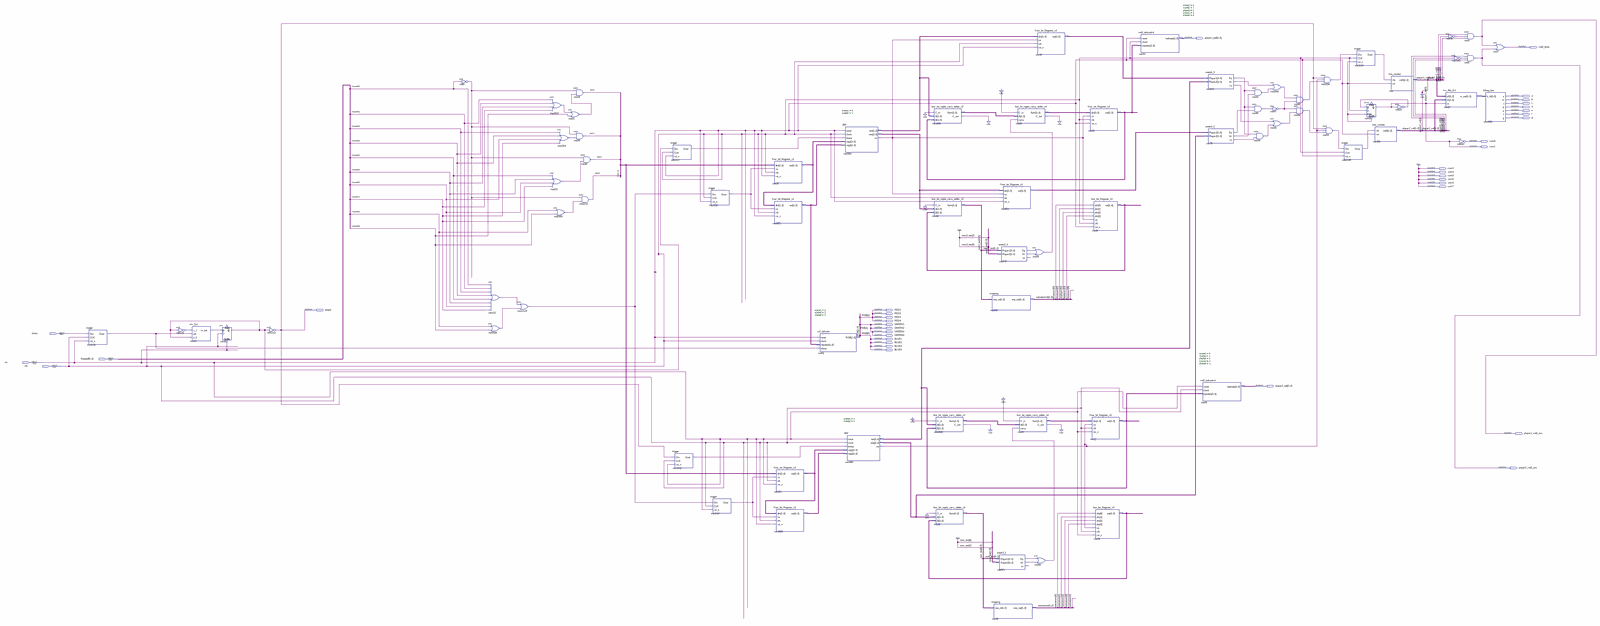
[diagram p0: schematic sheet, whole]
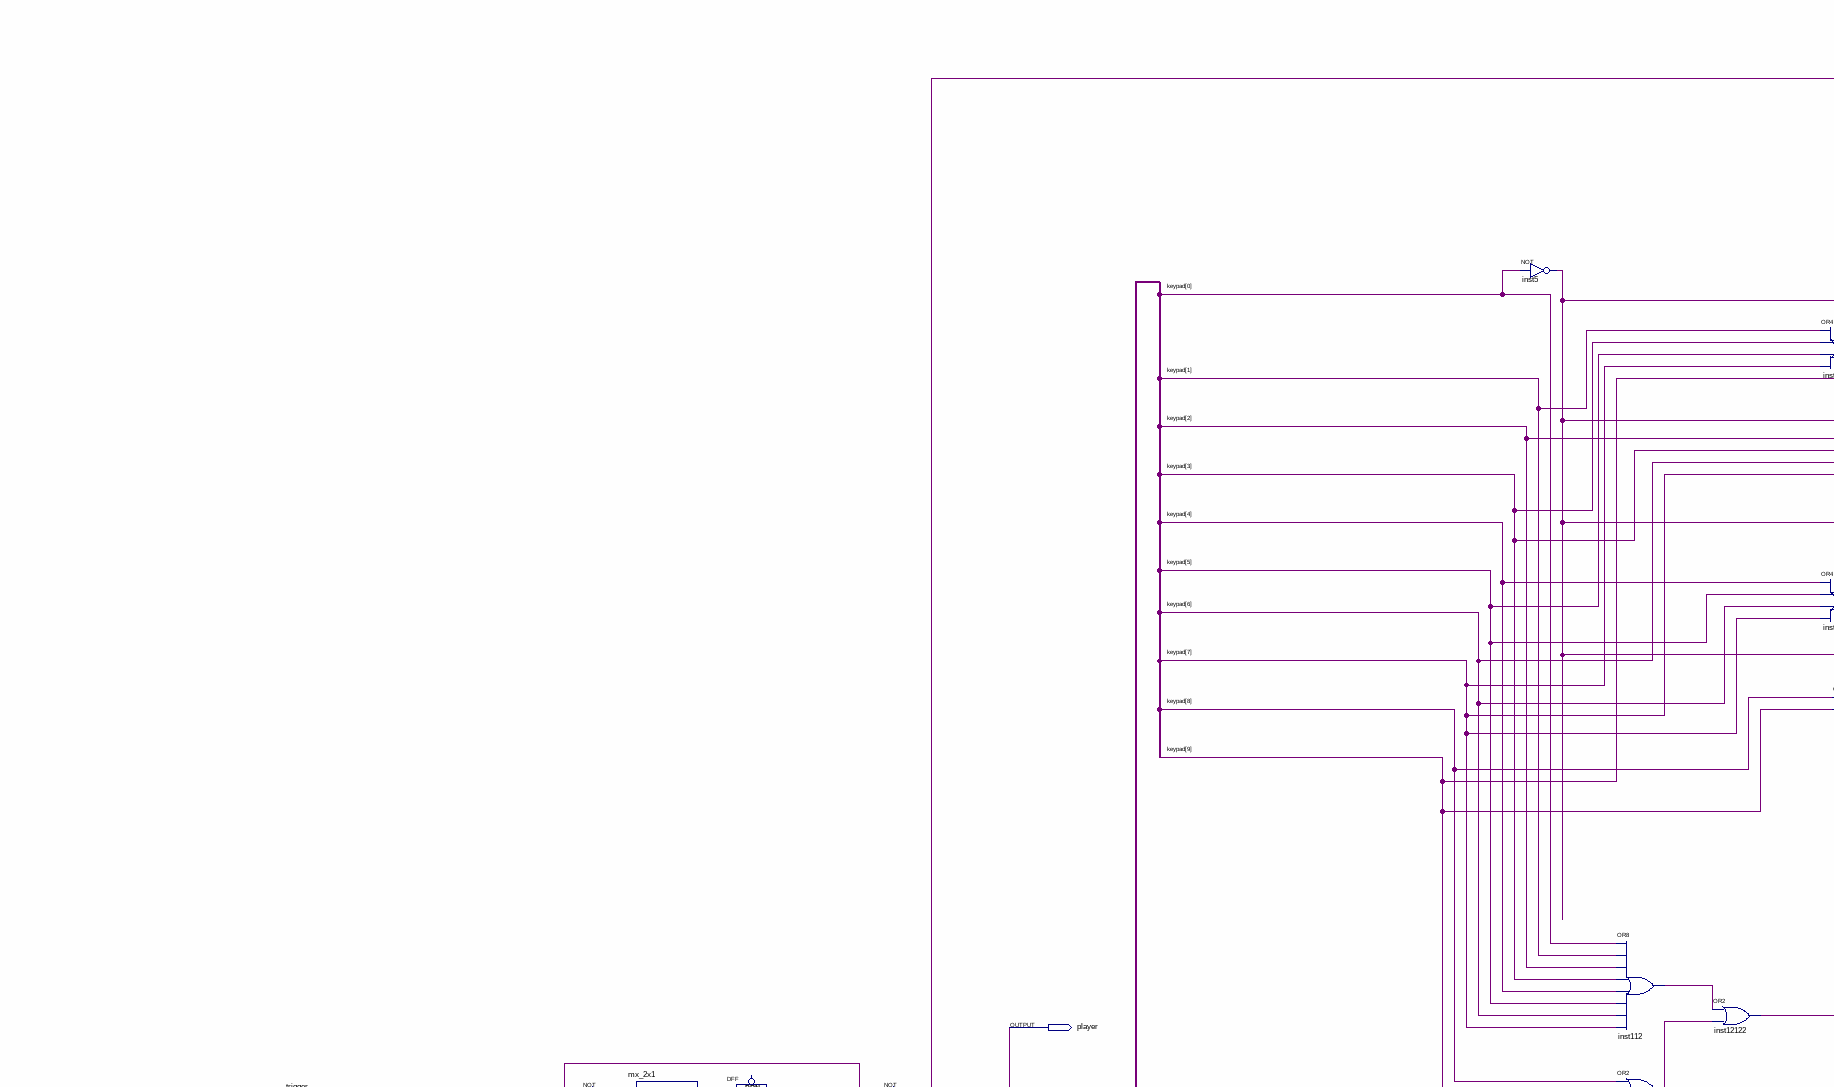
[diagram p1: schematic sheet, upper left part]
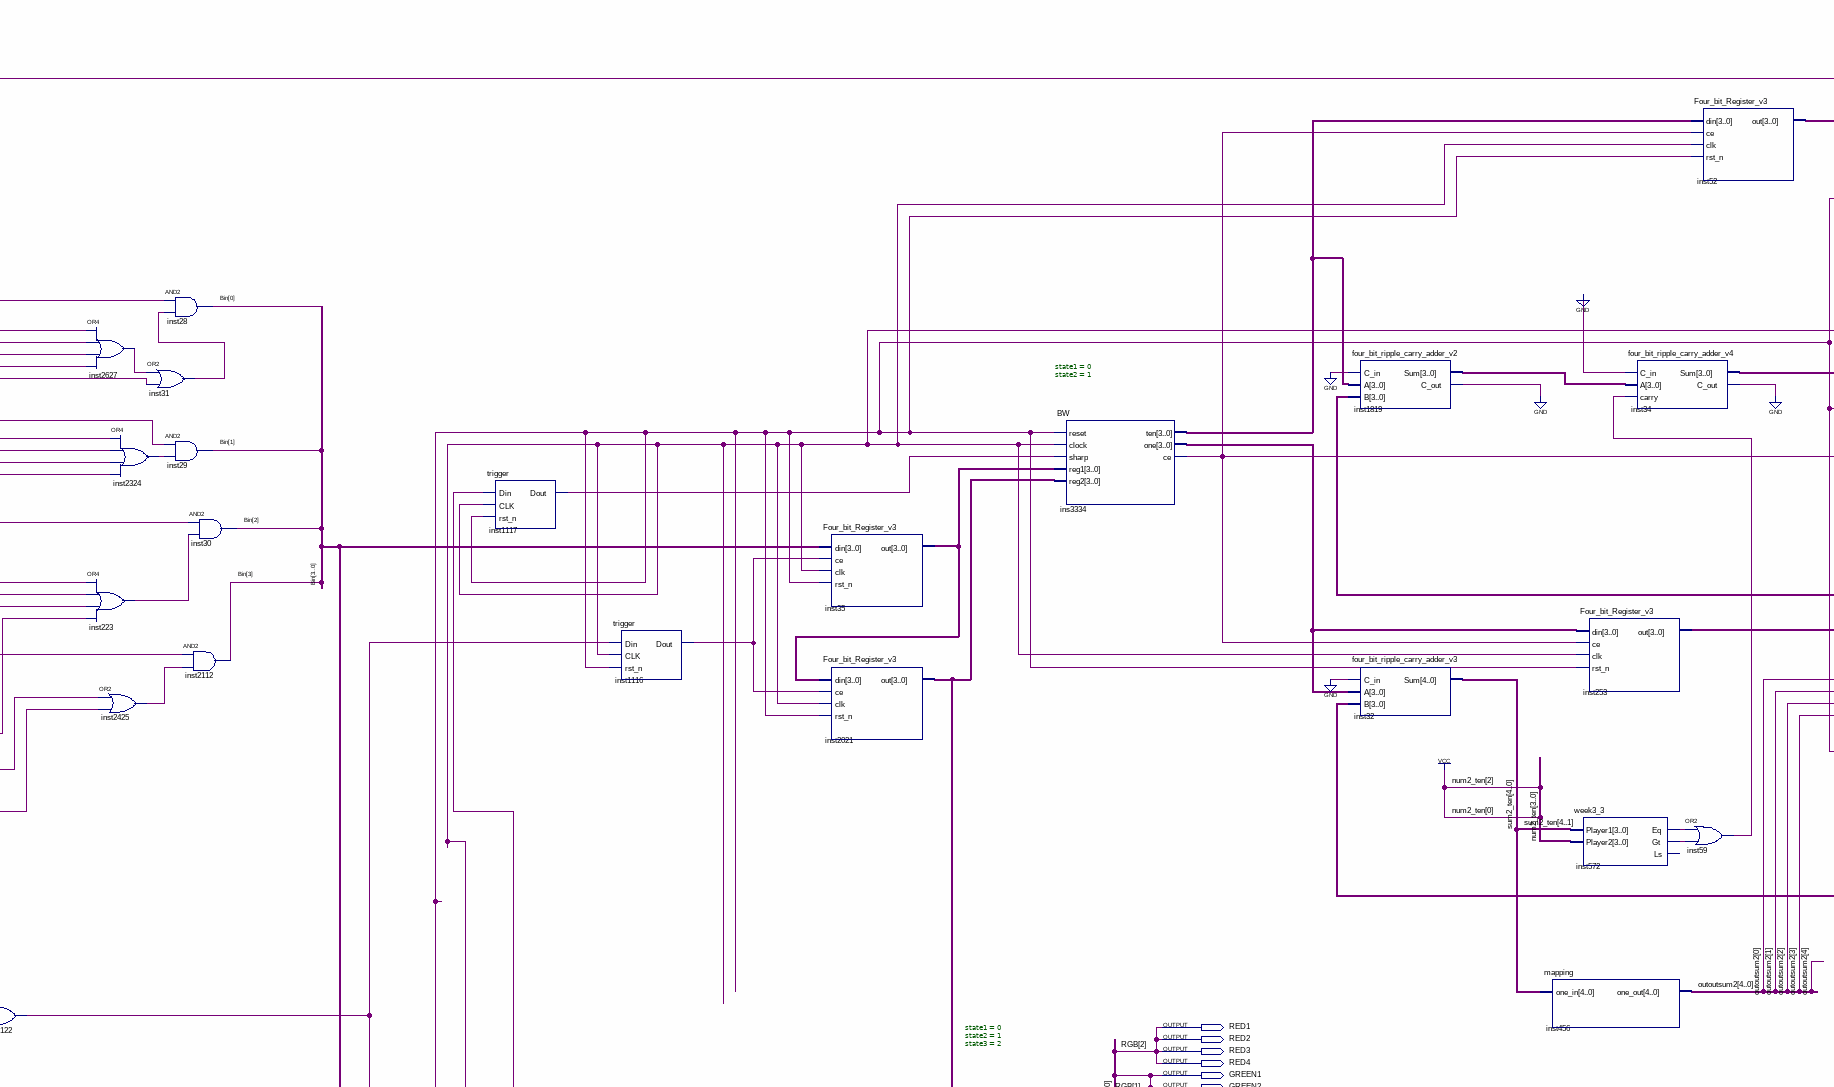
[diagram p2: schematic sheet, upper centre part]
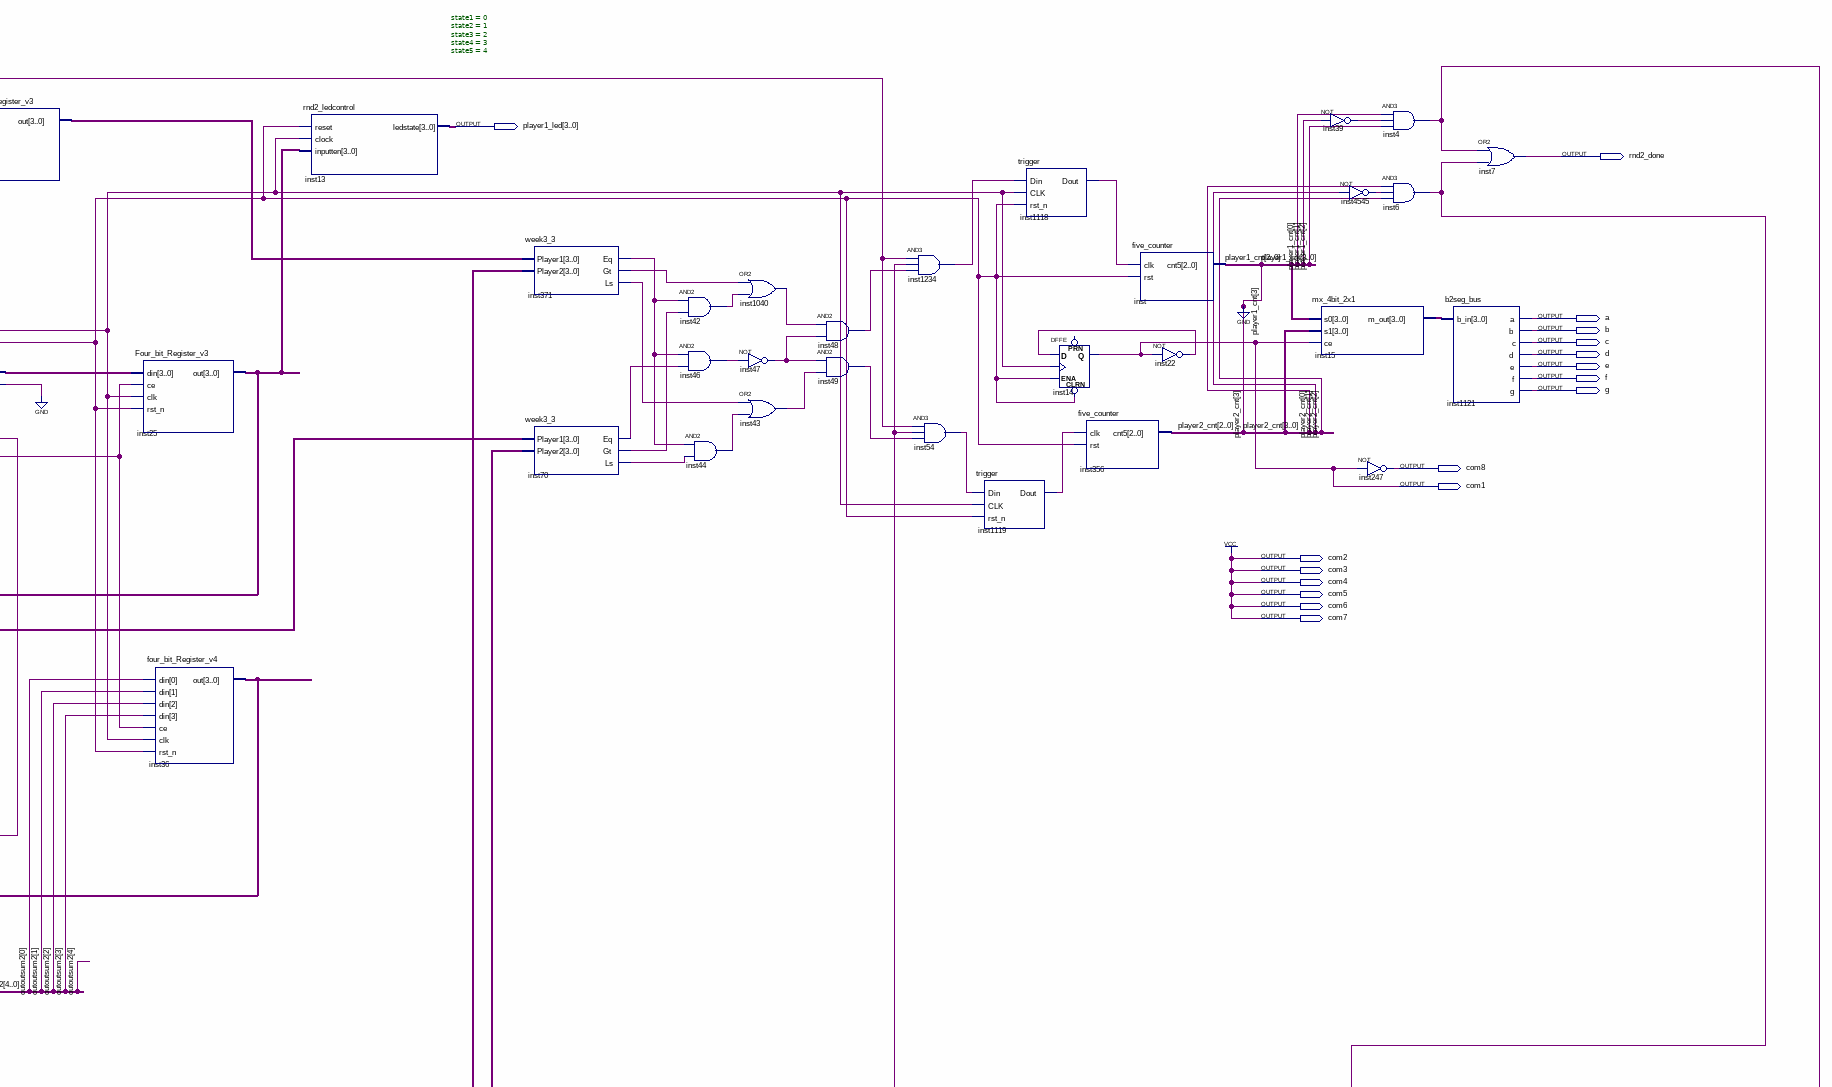
[diagram p3: schematic sheet, upper right part]
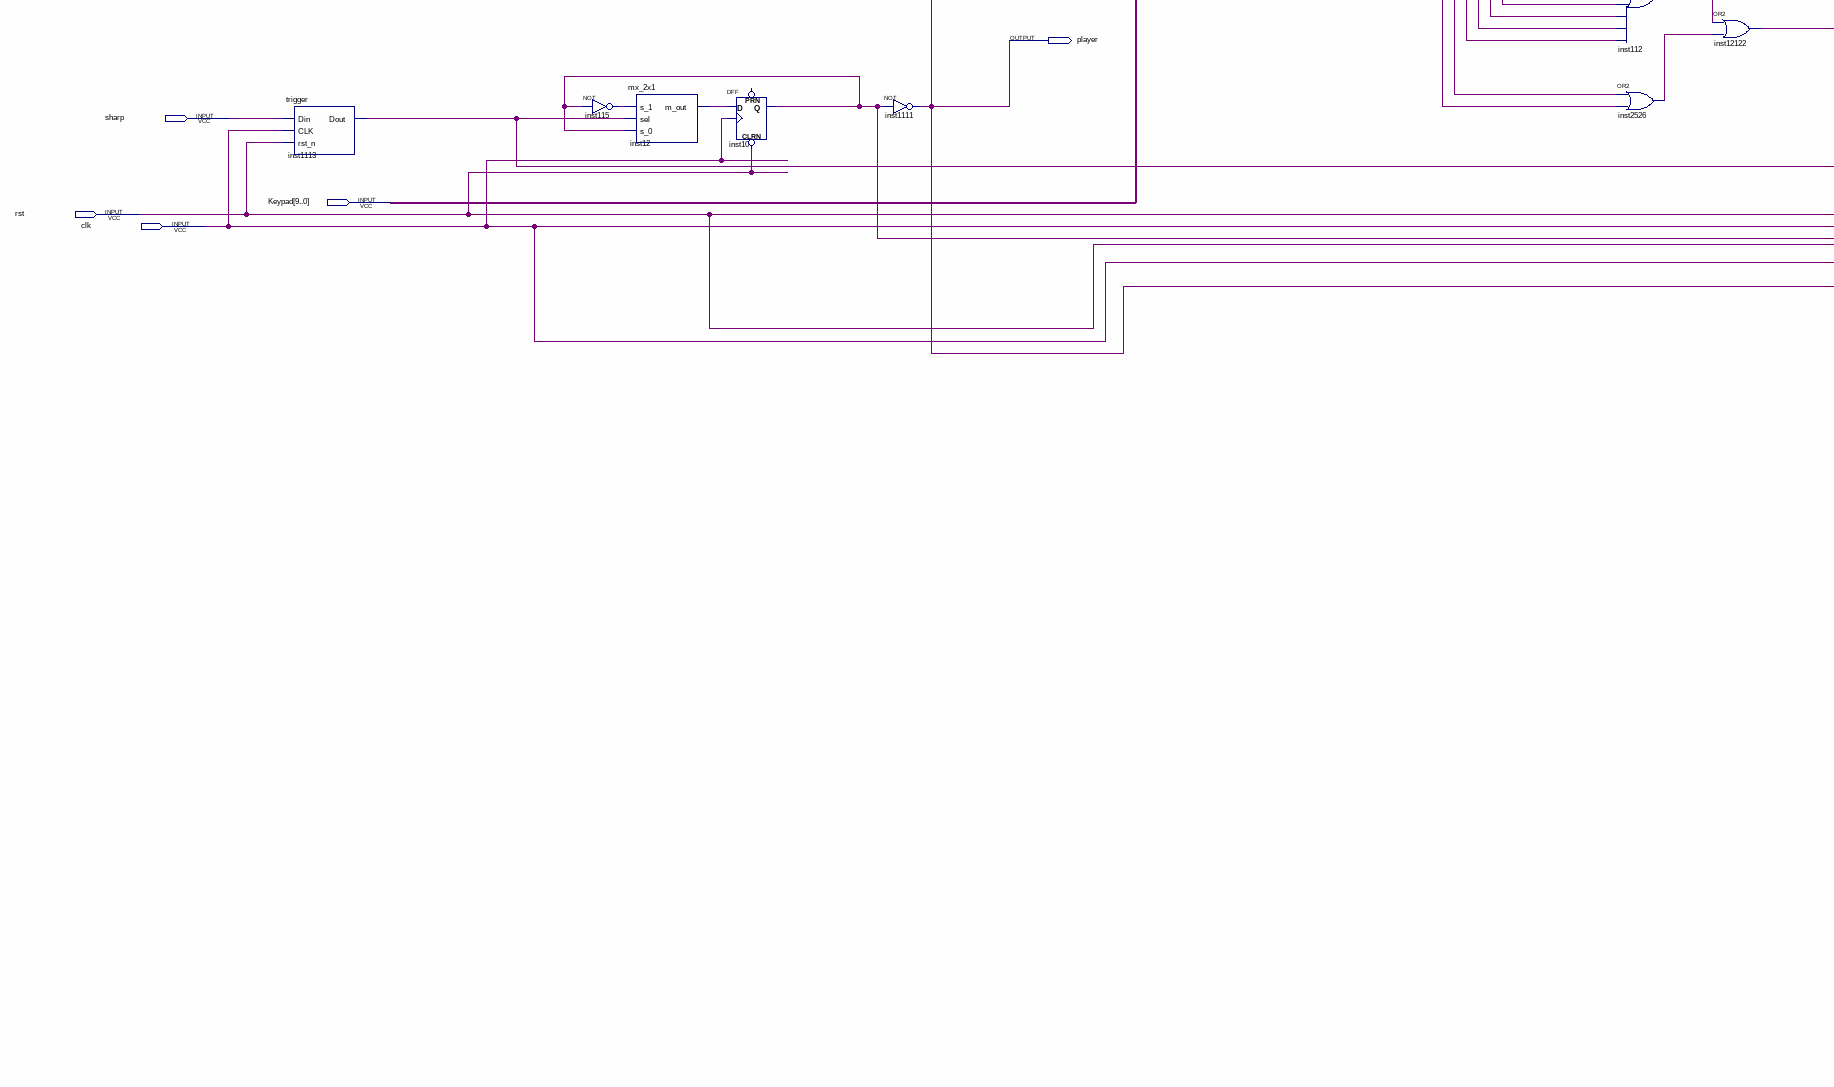
[diagram p4: schematic sheet, lower left part]
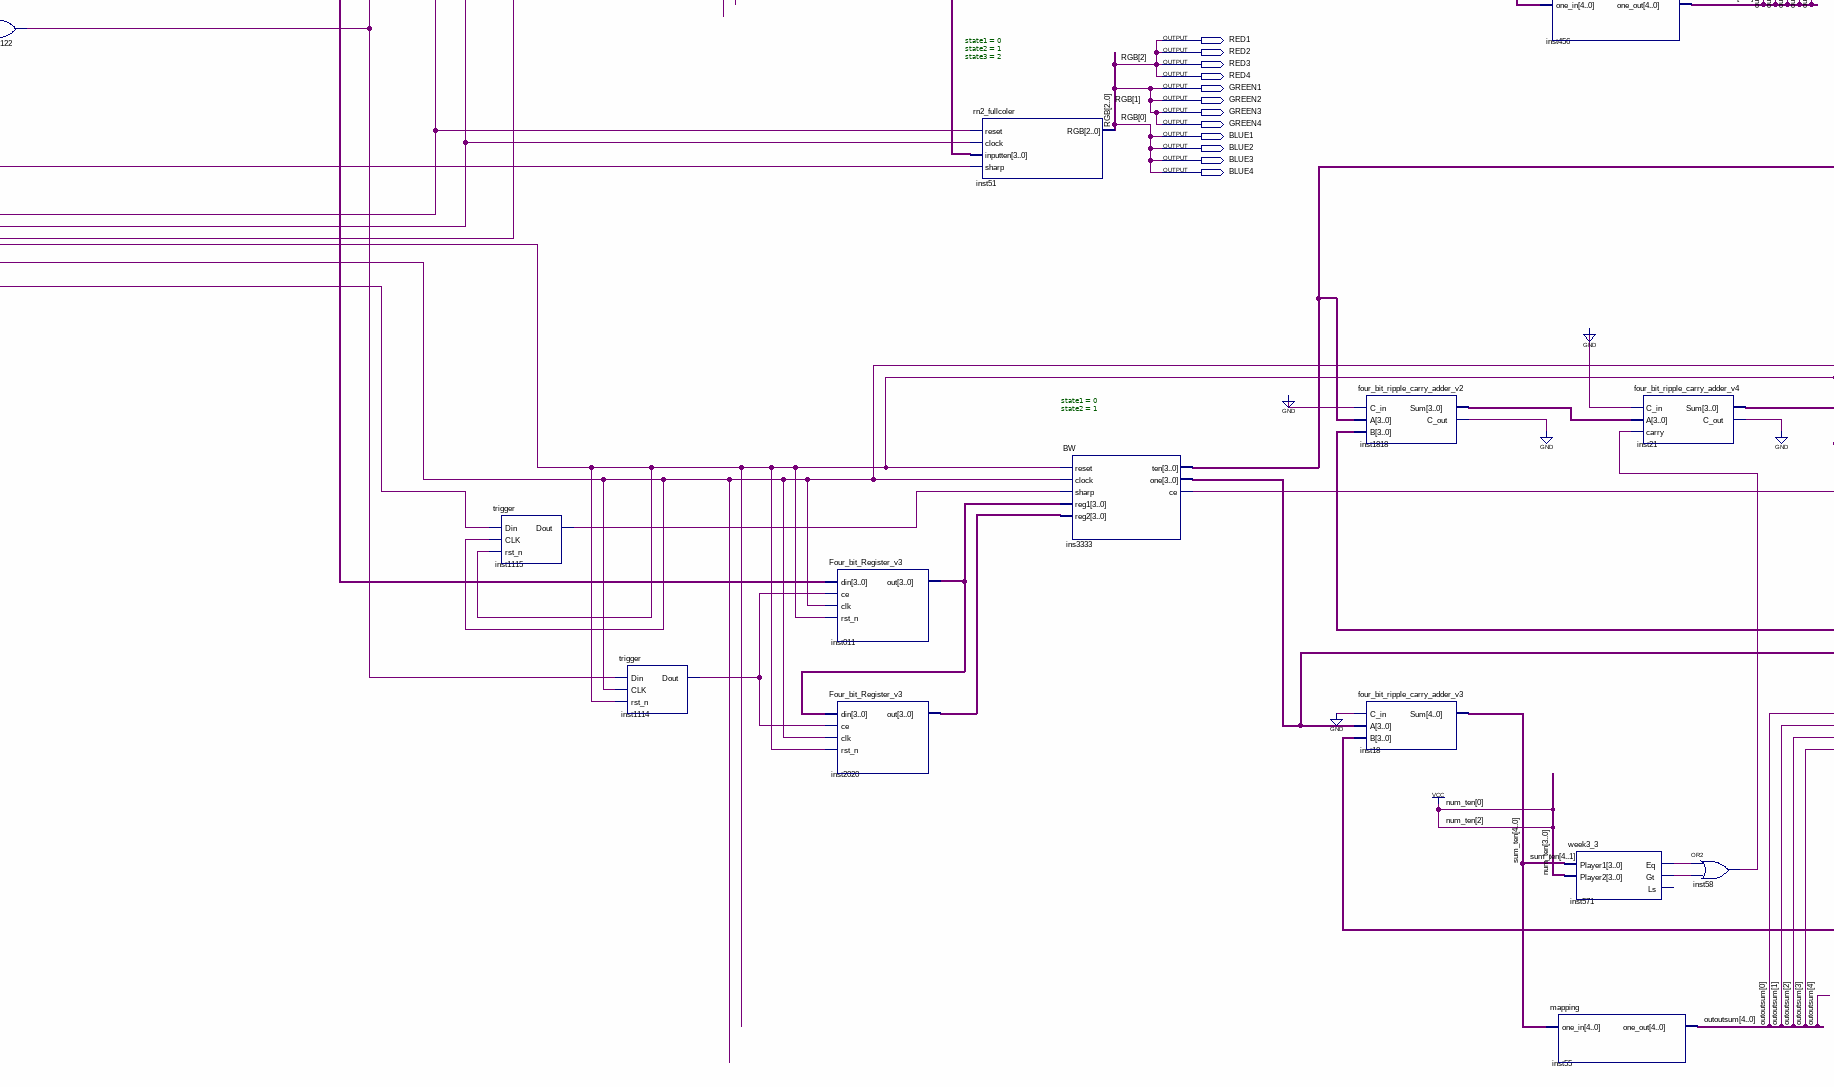
[diagram p5: schematic sheet, lower centre part]
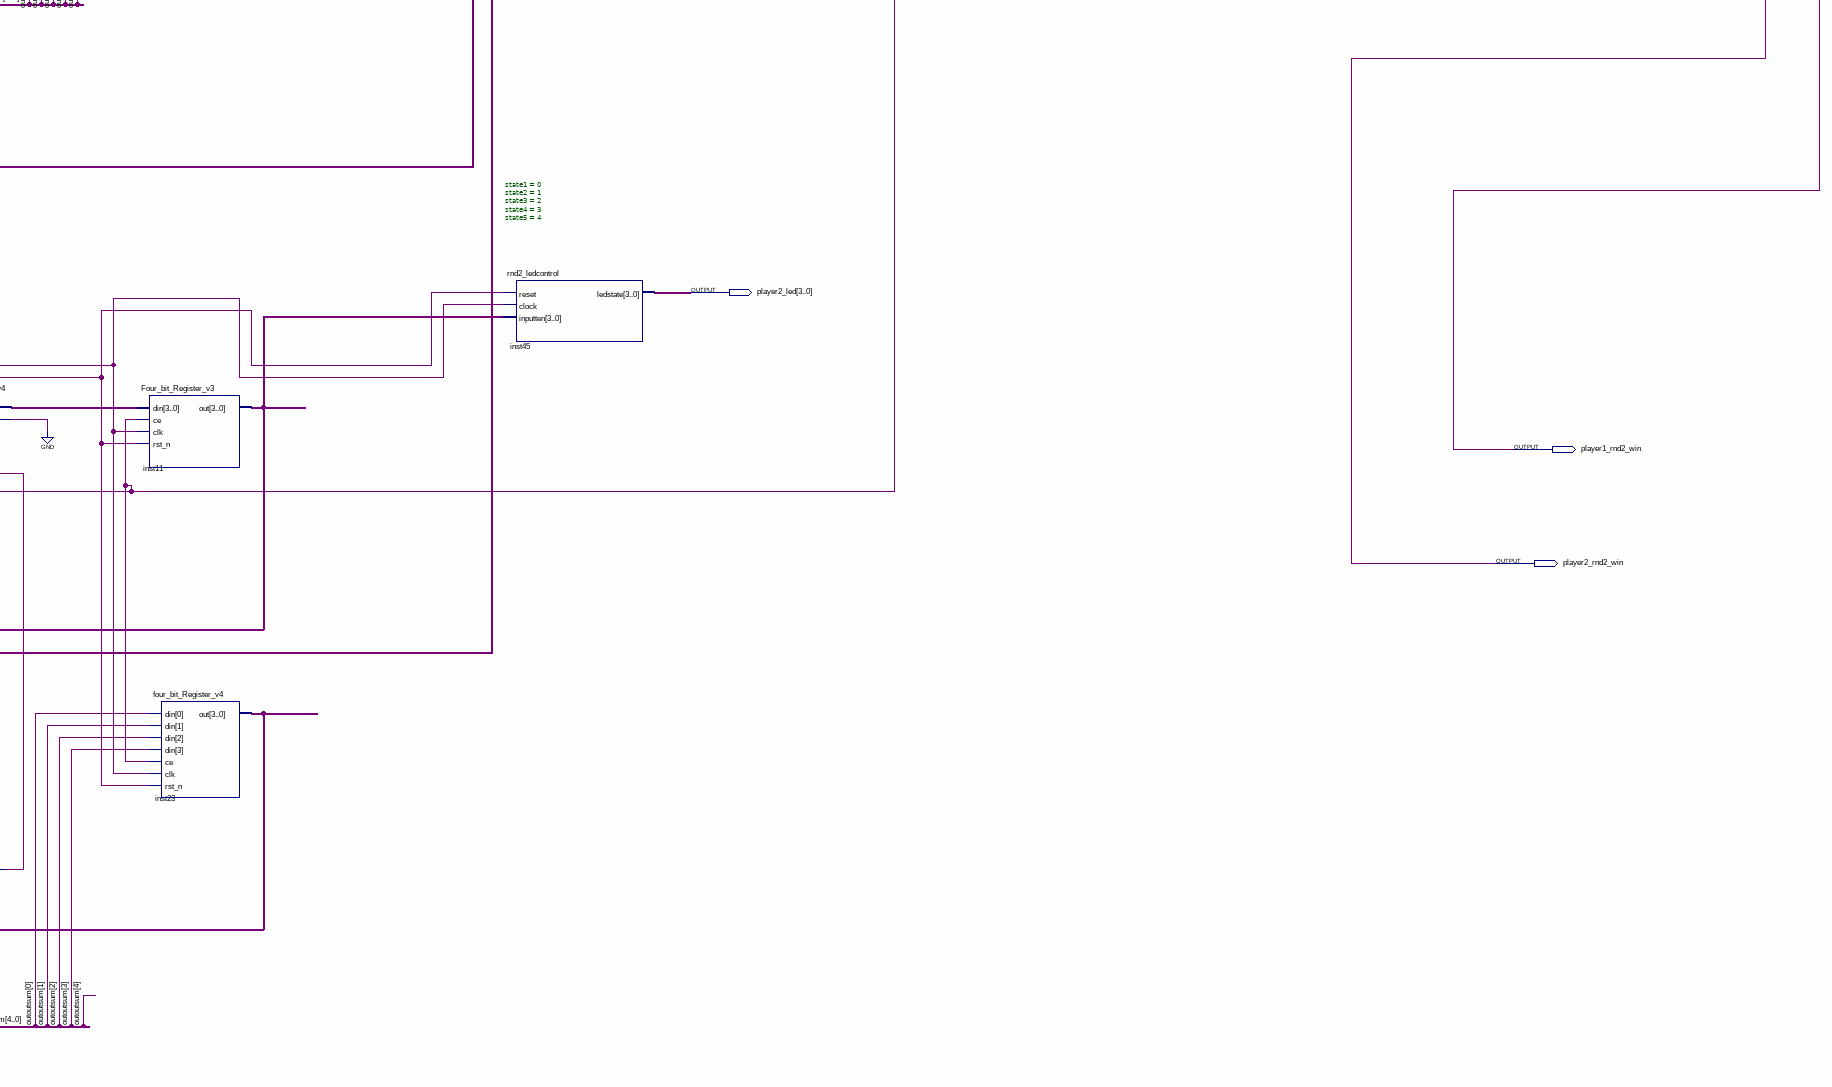
[diagram p6: schematic sheet, lower right part]
// Quartus schematic rnd2_player.bdf as structural Verilog: 75 symbols, 37 pins
module rnd2_player (
  input  sharp,
  input  [9:0] Keypad,
  input  rst,
  input  clk,
  output [3:0] player1_led,
  output rnd2_done,
  output a,
  output b,
  output c,
  output d,
  output e,
  output f,
  output g,
  output com8,
  output com1,
  output com2,
  output com3,
  output com4,
  output com5,
  output com6,
  output com7,
  output player,
  output RED1,
  output RED2,
  output RED3,
  output RED4,
  output GREEN1,
  output GREEN2,
  output GREEN3,
  output GREEN4,
  output BLUE1,
  output BLUE2,
  output BLUE3,
  output BLUE4,
  output [3:0] player2_led,
  output player1_rnd2_win,
  output player2_rnd2_win
);

  wire ins3333_ce, ins3334_ce, inst5_out, inst10_q, inst12_m_out, inst21_c_out, inst22_out, inst31_out,
       inst34_c_out, inst39_out, inst42_out, inst43_out, inst44_out, inst46_out, inst47_out, inst48_out,
       inst49_out, inst54_out, inst58_out, inst59_out, inst70_eq, inst70_gt, inst70_ls, inst112_out,
       inst115_out, inst223_out, inst371_eq, inst371_gt, inst371_ls, inst571_eq, inst571_gt, inst572_eq,
       inst572_gt, inst1040_out, inst1113_dout, inst1114_dout, inst1115_dout, inst1116_dout, inst1117_dout,
       inst1118_dout, inst1119_dout, inst1234_out, inst1818_c_out, inst1819_c_out, inst2324_out,
       inst2425_out, inst2526_out, inst2627_out, inst4545_out, inst12122_out;
  wire [2:0] player1_cnt, player2_cnt;
  wire [3:0] Bin, ins3333_one, ins3333_ten, ins3334_one, ins3334_ten, inst011_out, inst11_out, inst15_m_out,
       inst21_sum, inst23_out, inst25_out, inst34_sum, inst35_out, inst36_out, inst52_out, inst253_out,
       inst1818_sum, inst1819_sum, inst2020_out, inst2021_out;
  wire [3:1] num2_ten, num_ten;
  wire [4:0] outoutsum, outoutsum2, sum2_ten, sum_ten;

  trigger inst1113 (.Din(sharp), .CLK(clk), .rst_n(rst), .Dout(inst1113_dout));
  not inst115 (inst115_out, inst10_q);
  mx_2x1 inst12 (.s_1(inst115_out), .sel(inst1113_dout), .s_0(inst10_q), .m_out(inst12_m_out));
  DFF inst10 (.CLRN(rst), .CLK(clk), .D(inst12_m_out), .Q(inst10_q));  // open: PRN
  not inst1111 (player, inst10_q);
  not inst5 (inst5_out, Keypad[0]);
  or inst112 (inst112_out, Keypad[0], Keypad[1], Keypad[2], Keypad[3], Keypad[4], Keypad[5], Keypad[6], Keypad[7]);
  or inst2526 (inst2526_out, Keypad[8], Keypad[9]);
  or inst12122 (inst12122_out, inst112_out, inst2526_out);
  or inst2627 (inst2627_out, Keypad[1], Keypad[3], Keypad[5], Keypad[7]);
  or inst2324 (inst2324_out, Keypad[2], Keypad[3], Keypad[6], Keypad[7]);
  or inst223 (inst223_out, Keypad[4], Keypad[5], Keypad[6], Keypad[7]);
  or inst2425 (inst2425_out, Keypad[8], Keypad[9]);
  and inst28 (Bin[0], inst5_out, inst31_out);
  or inst31 (inst31_out, inst2627_out, Keypad[9]);
  and inst29 (Bin[1], inst5_out, inst2324_out);
  and inst30 (Bin[2], inst5_out, inst223_out);
  and inst2112 (Bin[3], inst5_out, inst2425_out);
  trigger inst1117 (.Din(inst10_q), .CLK(clk), .rst_n(rst), .Dout(inst1117_dout));
  trigger inst1115 (.Din(player), .CLK(clk), .rst_n(rst), .Dout(inst1115_dout));
  trigger inst1116 (.Din(inst12122_out), .CLK(clk), .rst_n(rst), .Dout(inst1116_dout));
  trigger inst1114 (.Din(inst12122_out), .CLK(clk), .rst_n(rst), .Dout(inst1114_dout));
  Four_bit_Register_v3 inst35 (.din(Bin), .ce(inst1116_dout), .clk(clk), .rst_n(rst), .out(inst35_out));
  Four_bit_Register_v3 inst2021 (.din(inst35_out), .ce(inst1116_dout), .clk(clk), .rst_n(rst), .out(inst2021_out));
  Four_bit_Register_v3 inst011 (.din(Bin), .ce(inst1114_dout), .clk(clk), .rst_n(rst), .out(inst011_out));
  Four_bit_Register_v3 inst2020 (.din(inst011_out), .ce(inst1114_dout), .clk(clk), .rst_n(rst), .out(inst2020_out));
  rn2_fullcoler #(.state1(0), .state2(1), .state3(2)) inst51 (
    .reset(rst), .clock(clk), .inputten(inst2021_out), .sharp(inst1113_dout), .RGB({RED1, GREEN1, BLUE1}));
  BW #(.state1(0), .state2(1)) ins3334 (
    .reset(rst), .clock(clk), .sharp(inst1117_dout), .reg1(inst35_out), .reg2(inst2021_out),
    .ten(ins3334_ten), .one(ins3334_one), .ce(ins3334_ce));
  BW #(.state1(0), .state2(1)) ins3333 (
    .reset(rst), .clock(clk), .sharp(inst1115_dout), .reg1(inst011_out), .reg2(inst2020_out),
    .ten(ins3333_ten), .one(ins3333_one), .ce(ins3333_ce));
  four_bit_ripple_carry_adder_v2 inst1819 (
    .C_in(1'b0), .A(ins3334_ten), .B(inst25_out), .Sum(inst1819_sum), .C_out(inst1819_c_out));
  four_bit_ripple_carry_adder_v3 inst32 (.C_in(1'b0), .A(ins3334_one), .B(inst36_out), .Sum(sum2_ten));
  four_bit_ripple_carry_adder_v2 inst1818 (
    .C_in(1'b0), .A(ins3333_ten), .B(inst11_out), .Sum(inst1818_sum), .C_out(inst1818_c_out));
  four_bit_ripple_carry_adder_v3 inst18 (.C_in(1'b0), .A(ins3333_one), .B(inst23_out), .Sum(sum_ten));
  week3_3 inst572 (
    .Player1(sum2_ten[4:1]), .Player2({num2_ten[3], 1'b1, num2_ten[1], 1'b1}), .Eq(inst572_eq),
    .Gt(inst572_gt));  // open: Ls
  mapping inst456 (.one_in(sum2_ten), .one_out(outoutsum2));
  week3_3 inst571 (
    .Player1(sum_ten[4:1]), .Player2({num_ten[3], 1'b1, num_ten[1], 1'b1}), .Eq(inst571_eq), .Gt(inst571_gt));  // open: Ls
  mapping inst55 (.one_in(sum_ten), .one_out(outoutsum));
  Four_bit_Register_v3 inst253 (.din(ins3334_one), .ce(ins3334_ce), .clk(clk), .rst_n(rst), .out(inst253_out));
  four_bit_ripple_carry_adder_v4 inst34 (
    .C_in(1'b0), .A(inst1819_sum), .carry(inst59_out), .Sum(inst34_sum), .C_out(inst34_c_out));
  four_bit_ripple_carry_adder_v4 inst21 (
    .C_in(1'b0), .A(inst1818_sum), .carry(inst58_out), .Sum(inst21_sum), .C_out(inst21_c_out));
  Four_bit_Register_v3 inst52 (.din(ins3334_ten), .ce(ins3334_ce), .clk(clk), .rst_n(rst), .out(inst52_out));
  or inst59 (inst59_out, inst572_eq, inst572_gt);
  or inst58 (inst58_out, inst571_eq, inst571_gt);
  Four_bit_Register_v3 inst25 (.din(inst34_sum), .ce(ins3334_ce), .clk(clk), .rst_n(rst), .out(inst25_out));
  four_bit_Register_v4 inst36 (.din(outoutsum2[3:0]), .ce(ins3334_ce), .clk(clk), .rst_n(rst), .out(inst36_out));
  Four_bit_Register_v3 inst11 (.din(inst21_sum), .ce(ins3333_ce), .clk(clk), .rst_n(rst), .out(inst11_out));
  four_bit_Register_v4 inst23 (.din(outoutsum[3:0]), .ce(ins3333_ce), .clk(clk), .rst_n(rst), .out(inst23_out));
  rnd2_ledcontrol #(.state1(0), .state2(1), .state3(2), .state4(3), .state5(4)) inst13 (
    .reset(rst), .clock(clk), .inputten(inst25_out), .ledstate(player1_led));
  rnd2_ledcontrol #(.state1(0), .state2(1), .state3(2), .state4(3), .state5(4)) inst45 (
    .reset(rst), .clock(clk), .inputten(inst11_out), .ledstate(player2_led));
  week3_3 inst371 (.Player1(inst52_out), .Player2(ins3333_ten), .Eq(inst371_eq), .Gt(inst371_gt), .Ls(inst371_ls));
  week3_3 inst70 (.Player1(inst253_out), .Player2(ins3333_one), .Eq(inst70_eq), .Gt(inst70_gt), .Ls(inst70_ls));
  and inst42 (inst42_out, inst371_eq, inst70_gt);
  and inst46 (inst46_out, inst371_eq, inst70_eq);
  and inst44 (inst44_out, inst371_eq, inst70_ls);
  or inst1040 (inst1040_out, inst371_gt, inst42_out);
  not inst47 (inst47_out, inst46_out);
  or inst43 (inst43_out, inst371_ls, inst44_out);
  and inst48 (inst48_out, inst1040_out, inst47_out);
  and inst49 (inst49_out, inst47_out, inst43_out);
  and inst1234 (inst1234_out, player, ins3333_ce, inst48_out);
  and inst54 (inst54_out, player, ins3333_ce, inst49_out);
  trigger inst1119 (.Din(inst54_out), .CLK(clk), .rst_n(rst), .Dout(inst1119_dout));
  trigger inst1118 (.Din(inst1234_out), .CLK(clk), .rst_n(rst), .Dout(inst1118_dout));
  DFFE inst14 (.CLRN(rst), .D(inst22_out), .CLK(clk), .ENA(rst), .Q(com1));  // open: PRN
  five_counter inst356 (.clk(inst1119_dout), .rst(rst), .cnt5(player2_cnt));
  five_counter inst (.clk(inst1118_dout), .rst(rst), .cnt5(player1_cnt));
  not inst22 (inst22_out, com1);
  not inst39 (inst39_out, player1_cnt[1]);
  mx_4bit_2x1 inst15 (.s0({1'b0, player1_cnt}), .s1({1'b0, player2_cnt}), .ce(com1), .m_out(inst15_m_out));
  not inst4545 (inst4545_out, player2_cnt[1]);
  not inst247 (com8, com1);
  and inst4 (player1_rnd2_win, player1_cnt[0], inst39_out, player1_cnt[2]);
  and inst6 (player2_rnd2_win, player2_cnt[0], inst4545_out, player2_cnt[2]);
  b2seg_bus inst1121 (.b_in(inst15_m_out), .a(a), .b(b), .c(c), .d(d), .e(e), .f(f), .g(g));
  or inst7 (rnd2_done, player1_rnd2_win, player2_rnd2_win);

  assign BLUE2 = BLUE1;
  assign BLUE3 = BLUE1;
  assign BLUE4 = BLUE1;
  assign com2 = 1'b1;
  assign com3 = 1'b1;
  assign com4 = 1'b1;
  assign com5 = 1'b1;
  assign com6 = 1'b1;
  assign com7 = 1'b1;
  assign GREEN2 = GREEN1;
  assign GREEN3 = GREEN1;
  assign GREEN4 = GREEN1;
  assign RED2 = RED1;
  assign RED3 = RED1;
  assign RED4 = RED1;
  // also tied to GND on the sheet: {inst1818_c_out, inst21_c_out, inst1819_c_out, inst34_c_out}

  // Other names for the same wires on the sheet: RGB[2:0] = {RED1, GREEN1, BLUE1}
endmodule
